# EasyEDA schematic SCH_traffic-light_2026-06-25.json
TITLE: Sheet_1; REV: 1.0; Date: 2026-06-25; Sheet: 1/1; Drawn By: bannuazmeera; Company: Your Company
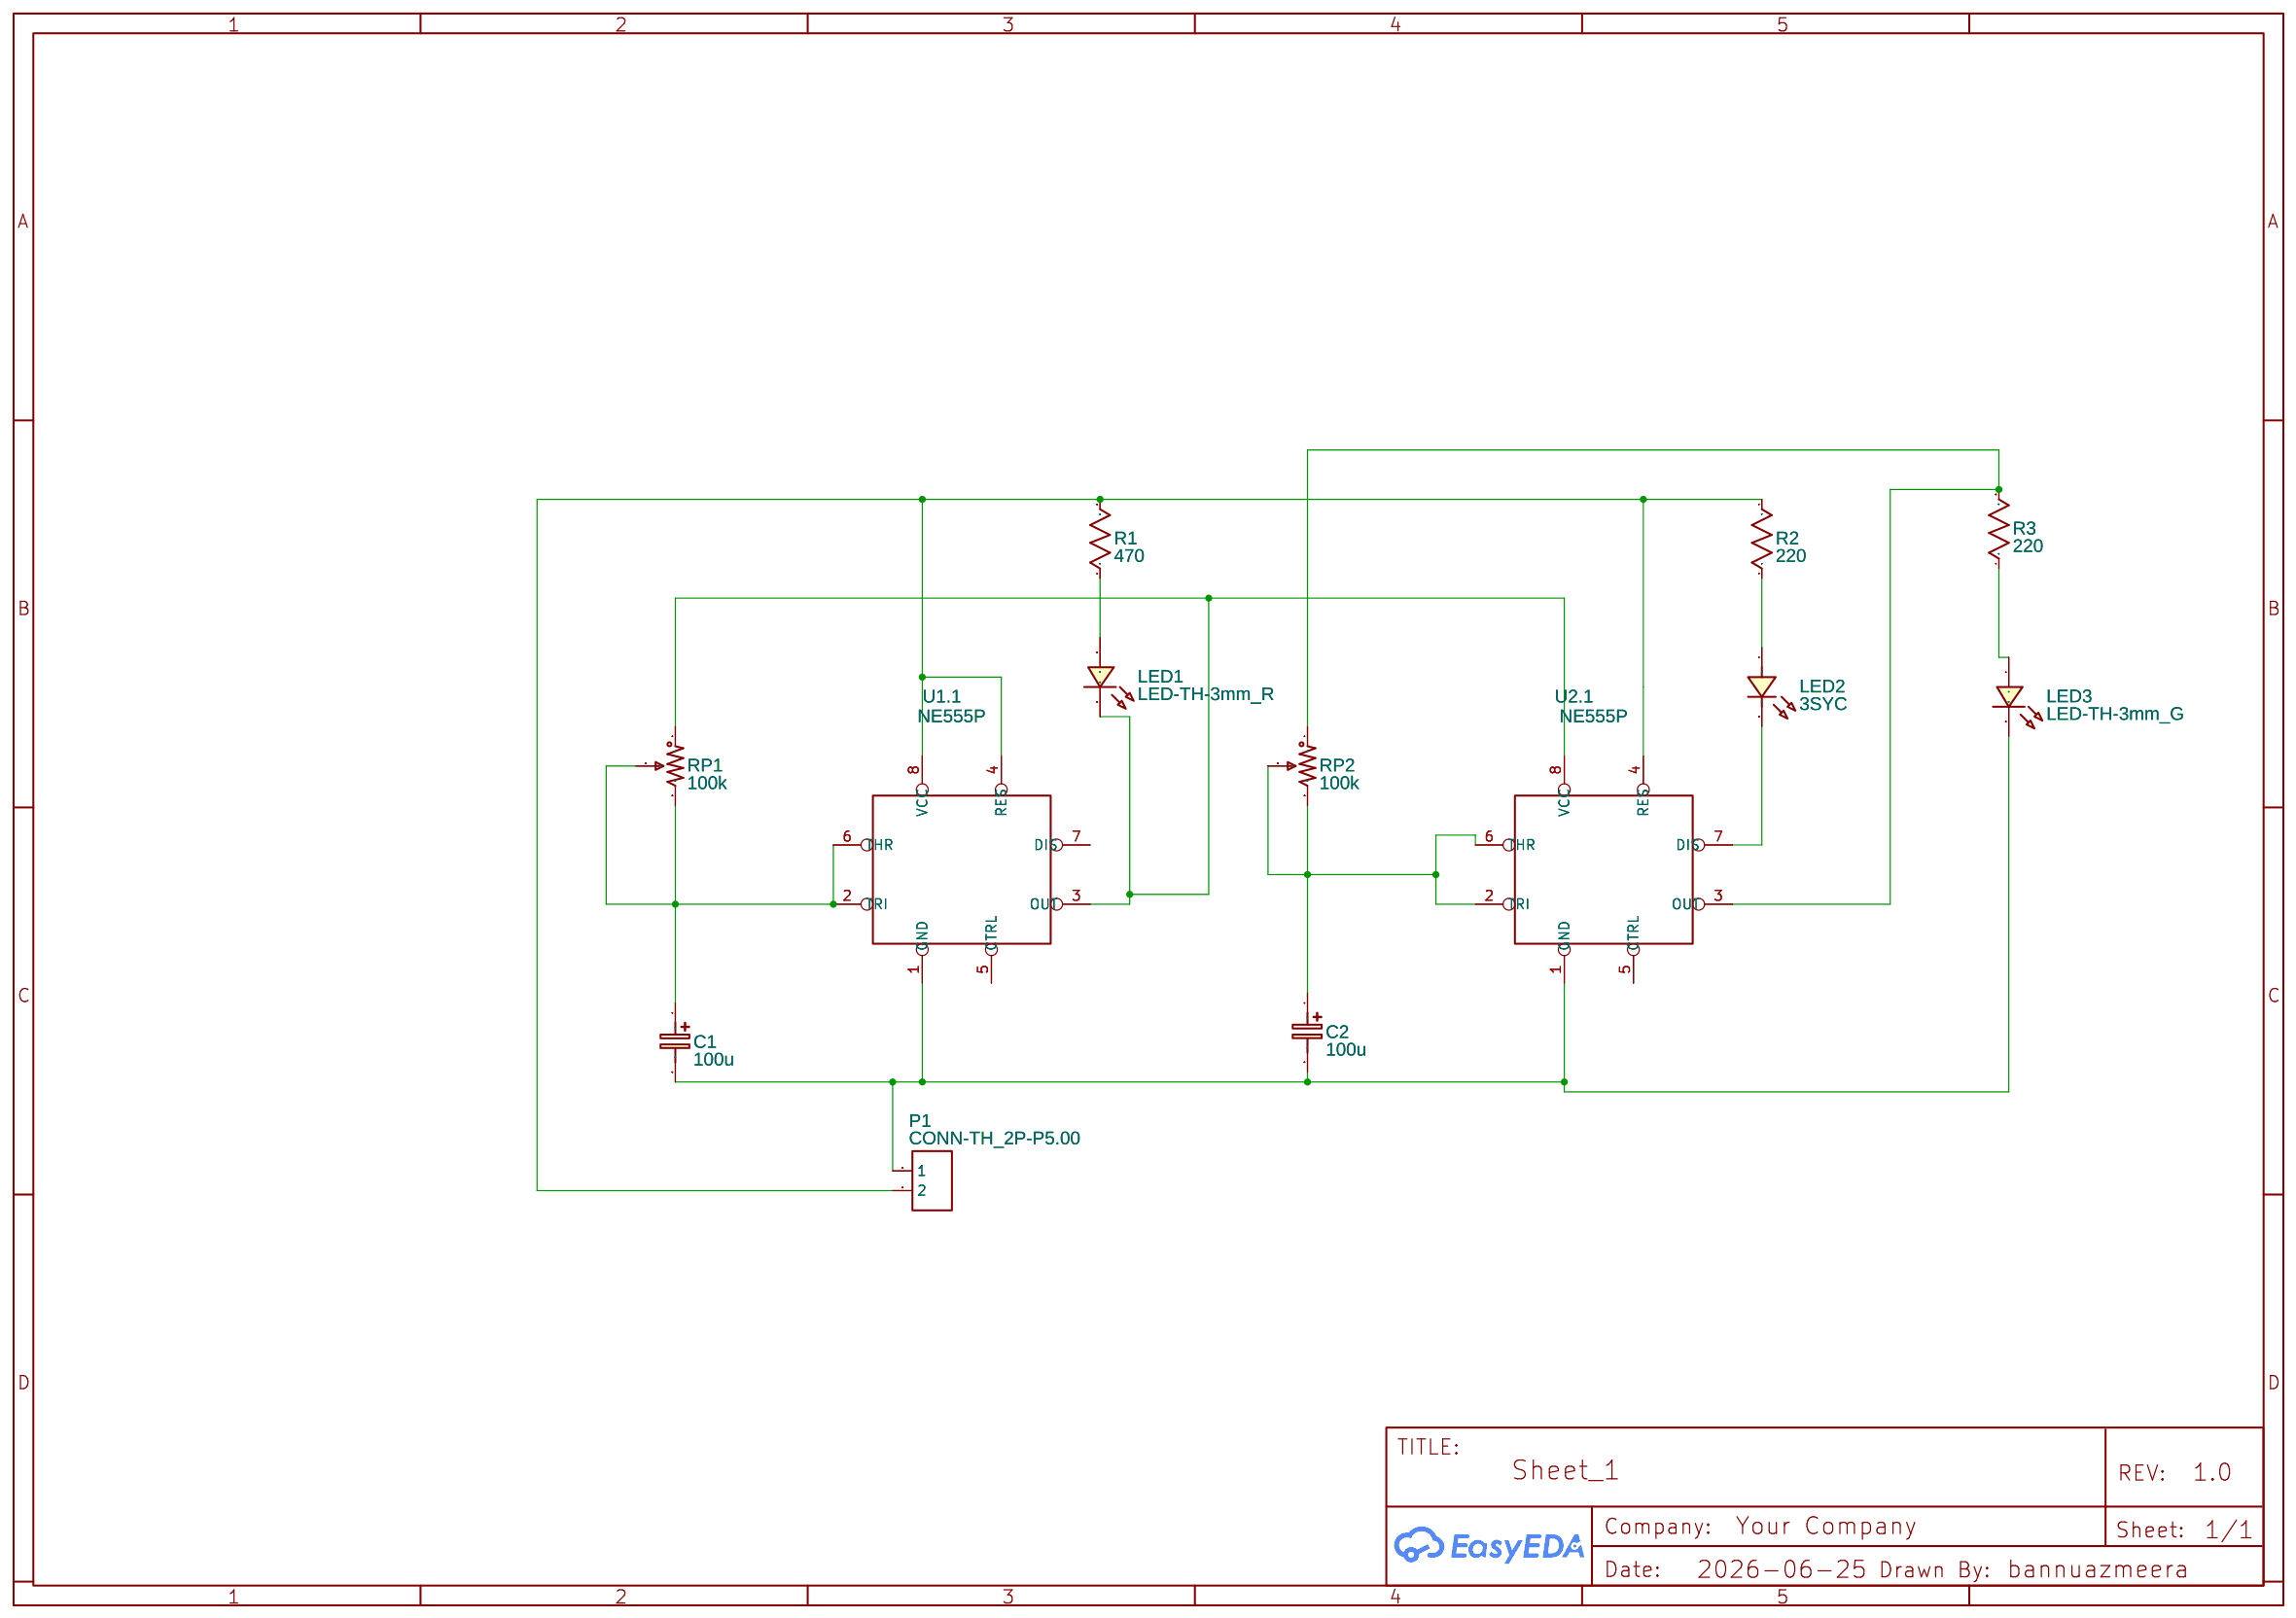
[diagram p0: schematic sheet]

## Parts
C1  100u  [CASE-A_3216]
C2  100u  [CASE-A_3216]
LED1  LED-TH-3mm_R  [LED-TH_BD3.0_RED]
LED2  3SYC  [LED-TH_BD3.0-P2.54-FD_YELLOW]
LED3  LED-TH-3mm_G  [LED-TH_BD3.0_GREEN]
P1  CONN-TH_2P-P5.00  [CONN-TH_2P-P5.00]
R1  470  [R0603]
R2  220  [R0603]
R3  220  [R0603]
RP1  100k  [RES-ADJ-TH_3386P]
RP2  100k  [RES-ADJ-TH_3386P]
U1  NE555P  [DIP-8_L9.8-W6.6-P2.54-LS7.6-BL]  (section 1)
U2  NE555P  [DIP-8_L9.8-W6.6-P2.54-LS7.6-BL]  (section 1)

## Library data of the parts
C1 C2 = C_Tan_SMD_A_EU: Contributor: LCEDA_Lib
LED1 = LED-TH-3mm_R: Manufacturer: EVERLIGHT(台湾亿光); Manufacturer Part: 204-10SDRD/S530-A3-L; Supplier Part: C84774; Supplier: LCSC; Contributor: LCEDA_Lib
LED2 = 3SYC: Supplier: LCSC; Supplier Part: C19327128; Manufacturer: BIVAR; JLCPCB Part Class: Extended Part; Contributor: lcsc
LED3 = LED-TH-3mm_G: Manufacturer: EVERLIGHT(台湾亿光); Manufacturer Part: 204-10SYGD/S530-E3; Supplier Part: C85161; Contributor: LCEDA_Lib
P1 = CONN-TH_2P-P5.00: Supplier: LCSC; Contributor: LCEDA_Lib
R1-R3 = R_0603_US: Contributor: LCEDA_Lib
RP1 RP2 = R_3386P_US: Supplier: LCSC; Contributor: LCEDA_Lib; value(Ω): 10K
U1 U2 = NE555: Supplier: LCSC; Manufacturer: TI(德州仪器); Supplier Part: C46749; JLCPCB Part Class: Extended Part; subpart_no: 1

## Nets
Net-(C1-1): C1.1 RP1.2 RP1.3 U1.2(TRI) U1.6(THR)
Net-(C1-2): C1.2 C2.2 LED3.2 P1.1 U1.1(GND) U2.1(GND)
Net-(C2-1): C2.1 RP2.2 RP2.3 U2.2(TRI) U2.6(THR)
Net-(LED1-1): LED1.1 R1.1
Net-(LED1-2): LED1.2 RP1.1 U1.3(OUT) U2.8(VCC)
Net-(LED2-1): LED2.1(A) R2.1
Net-(LED2-2): LED2.2(K) U2.7(DIS)
Net-(LED3-1): LED3.1 R3.1
Net-(P1-2): P1.2 R1.2 R2.2 U1.4(RES) U1.8(VCC) U2.4(RES)
Net-(R3-2): R3.2 RP2.1 U2.3(OUT)

Not connected (* = marked no-connect by the designer): U1 5(CTRL) 7(DIS); U2 5(CTRL)
